# EAGLE design 4Show (EAGLE 9.6.0)
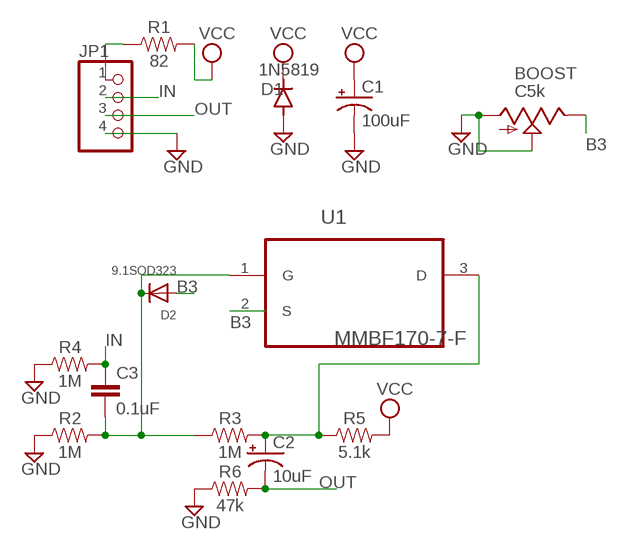
[diagram p0: schematic, sheet 1]

## Parts
BOOST  C5k  9MM_SNAP-IN_POT_  [9MM_SNAP-IN_POT]
C1  100uF  CAP_SMD+THRUPAN_B  [PAN_B_SMD+THRU]
C2  10uF  CAP_SMD+THRUPAN_B  [PAN_B_SMD+THRU]
C3  0.1uF  0.1UF-0603-25V-(+80/-20%)  [0603]
D1  1N5819  DIODE-SOD123  [SOD123]
D2  9.1SOD323  DIODESOD-323F  [SOD-323F]
JP1  PINHD-1X4  [1X04]
R1  82  82OHM-0603-1/10W-1%  [0603]
R2  1M  1MOHM-0603-1/4W-5%  [0603]
R3  1M  1MOHM-0603-1/4W-5%  [0603]
R4  1M  1MOHM-0603-1/4W-5%  [0603]
R5  5.1k  5.6KOHM-0603-1/10W-1%  [0603]
R6  47k  47KOHM-0603-1/10W-1%  [0603]
U1  MMBF170-7-F  [SOT103P240X110-3N]

## Nets
B3: BOOST.3(E) D2.A U1.2(S)
GND: BOOST.1(A) BOOST.2(S) C1.- C1.--(-) D1.A JP1.4 R2.1 R4.1 R6.1
IN: C3.1 JP1.2 R4.2
N$1: JP1.1 R1.1
N$2: C3.2 D2.C R2.2 R3.1 U1.1(G)
N$3: C2.+ C2.++(+) R3.2 R5.1 U1.3(D)
OUT: C2.- C2.--(-) JP1.3 R6.2
VCC: C1.+ C1.++(+) D1.C R1.2 R5.2

## Library data of the parts
BOOST = MusicThingModular:9MM_SNAP-IN_POT: 9mm vertical snap-in pot, Alpha / Panasonic style
C1 C2 = MusicThingModular:CAP_SMD+THRU
C3 = SparkFun-Capacitors:0.1UF: 0.1µF ceramic capacitors A capacitor is a passive two-terminal electrical component used to store electrical energy temporarily in an electric field.; PROD_ID: CAP-00810
D1 = diode:DIODE-: DIODE
D2 = adafruit:DIODE: Diode SMADIODE - SMA Surface Mount Package 20V 1A Schottky Diode Digikey: 641-1014-6-ND DO-1N4148 - Through Hole Small Current Diode SOD-123 20V 1 A (.5mV Vf) Schottky Diode - Digikey: MBRX120TPMSCT-ND SOD-323 10V 570mA (.38mV Vf, 3ns) Schottky Diode - Digikey: ZLLS410CT-ND SOD-523 30V 30mA Schottky Diode (RB751S-40TE61) - Digikey: RB751S-40TE61CT-ND SOT23-R/W - SOT23 Package (R = Solder Paste/Reflow Ovens, W = Hand-Soldering) BAT54Film 40V 300mA - Digikey: 497-7162-1-ND
JP1 = Connector:PINHD-1X4: PIN HEADER; CATEGORY: CONNECTOR; SUB-CATEGORY: PIN-HEADER
R1 = SparkFun-Resistors:82OHM: 82Ω resistor A resistor is a passive two-terminal electrical component that implements electrical resistance as a circuit element. Resistors act to reduce current flow, and, at the same time, act to lower voltage levels within circuits. - Wikipedia; PROD_ID: RES-12311
R2-R4 = SparkFun-Resistors:1MOHM: 1MΩ resistor A resistor is a passive two-terminal electrical component that implements electrical resistance as a circuit element. Resistors act to reduce current flow, and, at the same time, act to lower voltage levels within circuits. - Wikipedia; PROD_ID: RES-07868
R5 = SparkFun-Resistors:5.6KOHM: 5.6kΩ resistor A resistor is a passive two-terminal electrical component that implements electrical resistance as a circuit element. Resistors act to reduce current flow, and, at the same time, act to lower voltage levels within circuits. - Wikipedia; PROD_ID: RES-12378; VALUE: 5.6k
R6 = SparkFun-Resistors:47KOHM: 47kΩ resistor A resistor is a passive two-terminal electrical component that implements electrical resistance as a circuit element. Resistors act to reduce current flow, and, at the same time, act to lower voltage levels within circuits. - Wikipedia; PROD_ID: RES-07871
U1 = MMBF170-7-F:MMBF170-7-F: N-CHANNEL ENHANCEMENT MODE FIELD EFFECT TRANSISTOR; AVAILABILITY: Unavailable; DESCRIPTION: N-Channel 60V 500mA _Ta_ 300mW _Ta_ Surface Mount SOT-23-3; MF: Diodes Inc.; MP: MMBF170-7-F; PACKAGE: SOT-23-3 Diodes Inc.; PRICE: None

## Board
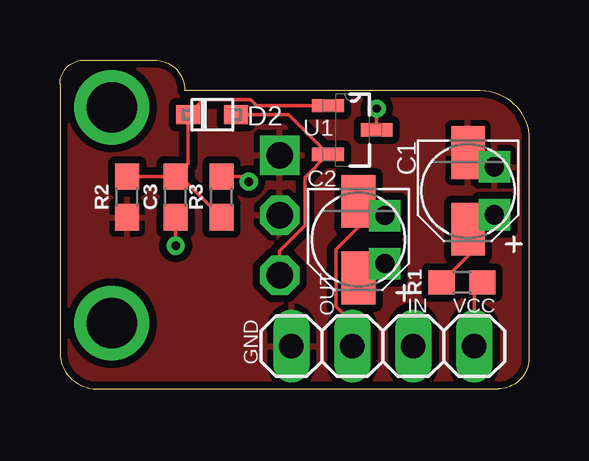
[diagram p1: board, top side]
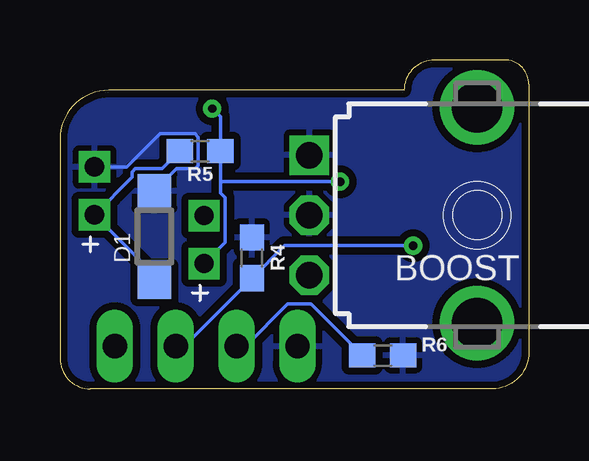
[diagram p2: board, bottom side, seen from below]

Size 19.56 x 13.72 mm. Coordinates in mm from the lower left corner, seen from the top.
Outline: 1.78,0 18.29,0 arc90 19.56,1.27 19.56,10.41 arc90 17.53,12.45 5.21,12.45 arc90 3.94,13.72 1.02,13.72 arc90 0,12.7 0,1.52 arc90 1.52,0 1.78,0
Copper layers (1*16): Top 0.035mm / dielectric 1.5mm / Bottom 0.035mm
Design rules "default *": minimum track width 6mil, minimum drill 0.35mm, track to track 6mil, track to pad 6mil, pad to pad 6mil, via to via 6mil, smd to smd 6mil, copper to edge 6mil, drill to drill 6mil, minimum pad ring 10mil, minimum via ring 8mil, stop-mask expansion 4mil, vias tented up to drill 0mil, thermal gap 10mil

### Footprints (pad centres in the part's own frame; a part is rotated, then mirrored left to right if it is on the bottom)
9MM_SNAP-IN_POT = drill 1.1 square: 1 -2.5,-7 | drill 1.1 octagon: 2 0,-7; 3 2.5,-7 | drill 2.1 pad 2.794: CHASSIS1 -4.5,0; CHASSIS2 4.5,0
PAN_B_SMD+THRU = smd 2.2 x 1.4: + 1.6,0; - -1.6,0 | drill 0.8 pad 0.9 square: ++ 1,1.1; -- -1,1.1
0603 = smd 1.1 x 1: 1 -0.85,0; 2 0.85,0
SOD123 = smd 1.4 x 1.4: A 1.9,0; C -1.9,0
SOD-323F = smd 1 x 0.8: A -1,0; C 1,0
1X04 = drill 1.016 long: 1 -3.81,0; 2 -1.27,0; 3 1.27,0; 4 3.81,0
SOT103P240X110-3N = smd 1.321 x 0.559: 1 -1.016,1.016; 2 -1.016,-1.016; 3 1.016,0

### Placement (x,y rotation side)
BOOST  2.16,7.24 270 bottom
C1  17.02,8.26 270 top
C2  12.45,6.22 270 top
C3  4.83,8 90 top
D1  15.62,6.35 90 bottom
D2  6.35,11.43 180 top
JP1  13.46,1.78 180 top
R1  16.76,4.45 180 top
R2  2.79,8 90 top
R3  6.73,8 90 top
R4  11.56,5.46 270 bottom
R5  13.72,9.91 180 bottom
R6  6.1,1.4 180 bottom
U1  12.19,10.79 0 top

### Tracks (layer width: path | path; a pad name or v marks a point on that pad's centre or on a via)
B3
  Top 0.152: D2.A 9.53,11.43 U1.2 10.21,8.82 10.21,6.8 9.16,5.75 BOOST.3
GND
  Top 0.152: C1.- 17.52,9.86 C1.--
  Bottom 0.152: C1.-- 16.77,9.26 15.39,10.63 13.92,10.63 13.79,10.5 13.79,9.31 13.92,9.18 14.69,9.18 D1.A
  pour Top (isolate 0.305): -0.25,13.84 -0.25,-0.51 -0.13,-0.64 19.3,-0.64 19.94,0 19.94,13.72 19.68,13.97 -0.13,13.97
  pour Bottom (isolate 0.305): -0.25,13.84 -0.25,-0.38 -0.13,-0.51 19.43,-0.51 20.07,0.13 20.07,13.34 19.43,13.97 -0.13,13.97
IN  (via drill 0.35)
  Top 0.152: C3.1 v4.83,5.97
  Bottom 0.152: JP1.2 14.39,1.78 R4.2 10.2,5.97 v4.83,5.97
N$1
  Top 0.152: JP1.1 17.27,4.1 R1.1
N$2
  Top 0.152: C3.2 5.35,9.38 D2.C 5.98,12.06 7.95,12.06 8.19,11.81 U1.1 | C3.2 5.03,8.85 R3.1 | R2.2 C3.2
N$3  (via drill 0.35)
  Top 0.152: v13.21,11.68 U1.3 | R3.2 7.66,8.85 v7.87,8.64 | C2.+ 12.95,4.62 C2.++
  Bottom 0.152: v13.21,11.68 12.87,11.34 R5.1 12.87,8.64 | 12.87,8.64 12.87,8.17 12.66,7.97 12.66,6.11 C2.++ | v7.87,8.64 12.87,8.64
OUT
  Top 0.152: C2.-- 13.05,7.22 C2.- 12.45,6.75 11.52,5.82 11.52,3.43 12.19,2.75 JP1.3
  Bottom 0.152: JP1.3 11.81,1.78 10.06,3.53 9.08,3.53 R6.2
VCC
  Top 0.152: R1.2 17.02,5.55 C1.+ 17.62,7.25 C1.++
  Bottom 0.152: D1.C 15.62,4.76 C1.++ 16.55,8.82 16.55,9.04 16.42,9.18 15.29,9.18 R5.2

### Text on the board
tPlace: OUT | IN | VCC | GND